# Altium schematic sheet Block_diagram.SchDoc
size C; Author: AM; CompanyName: Expatria Technologies; DrawnBy: A.Marles; Engineer: AM; Organization: Expatria Technolgoies; Address1: PO Box 2084; Address3: Merritt, BC V1K 1B8; Address4: Canada; DocumentNumber: 3; Revision: A2; SheetNumber: 3; SheetTotal: 26
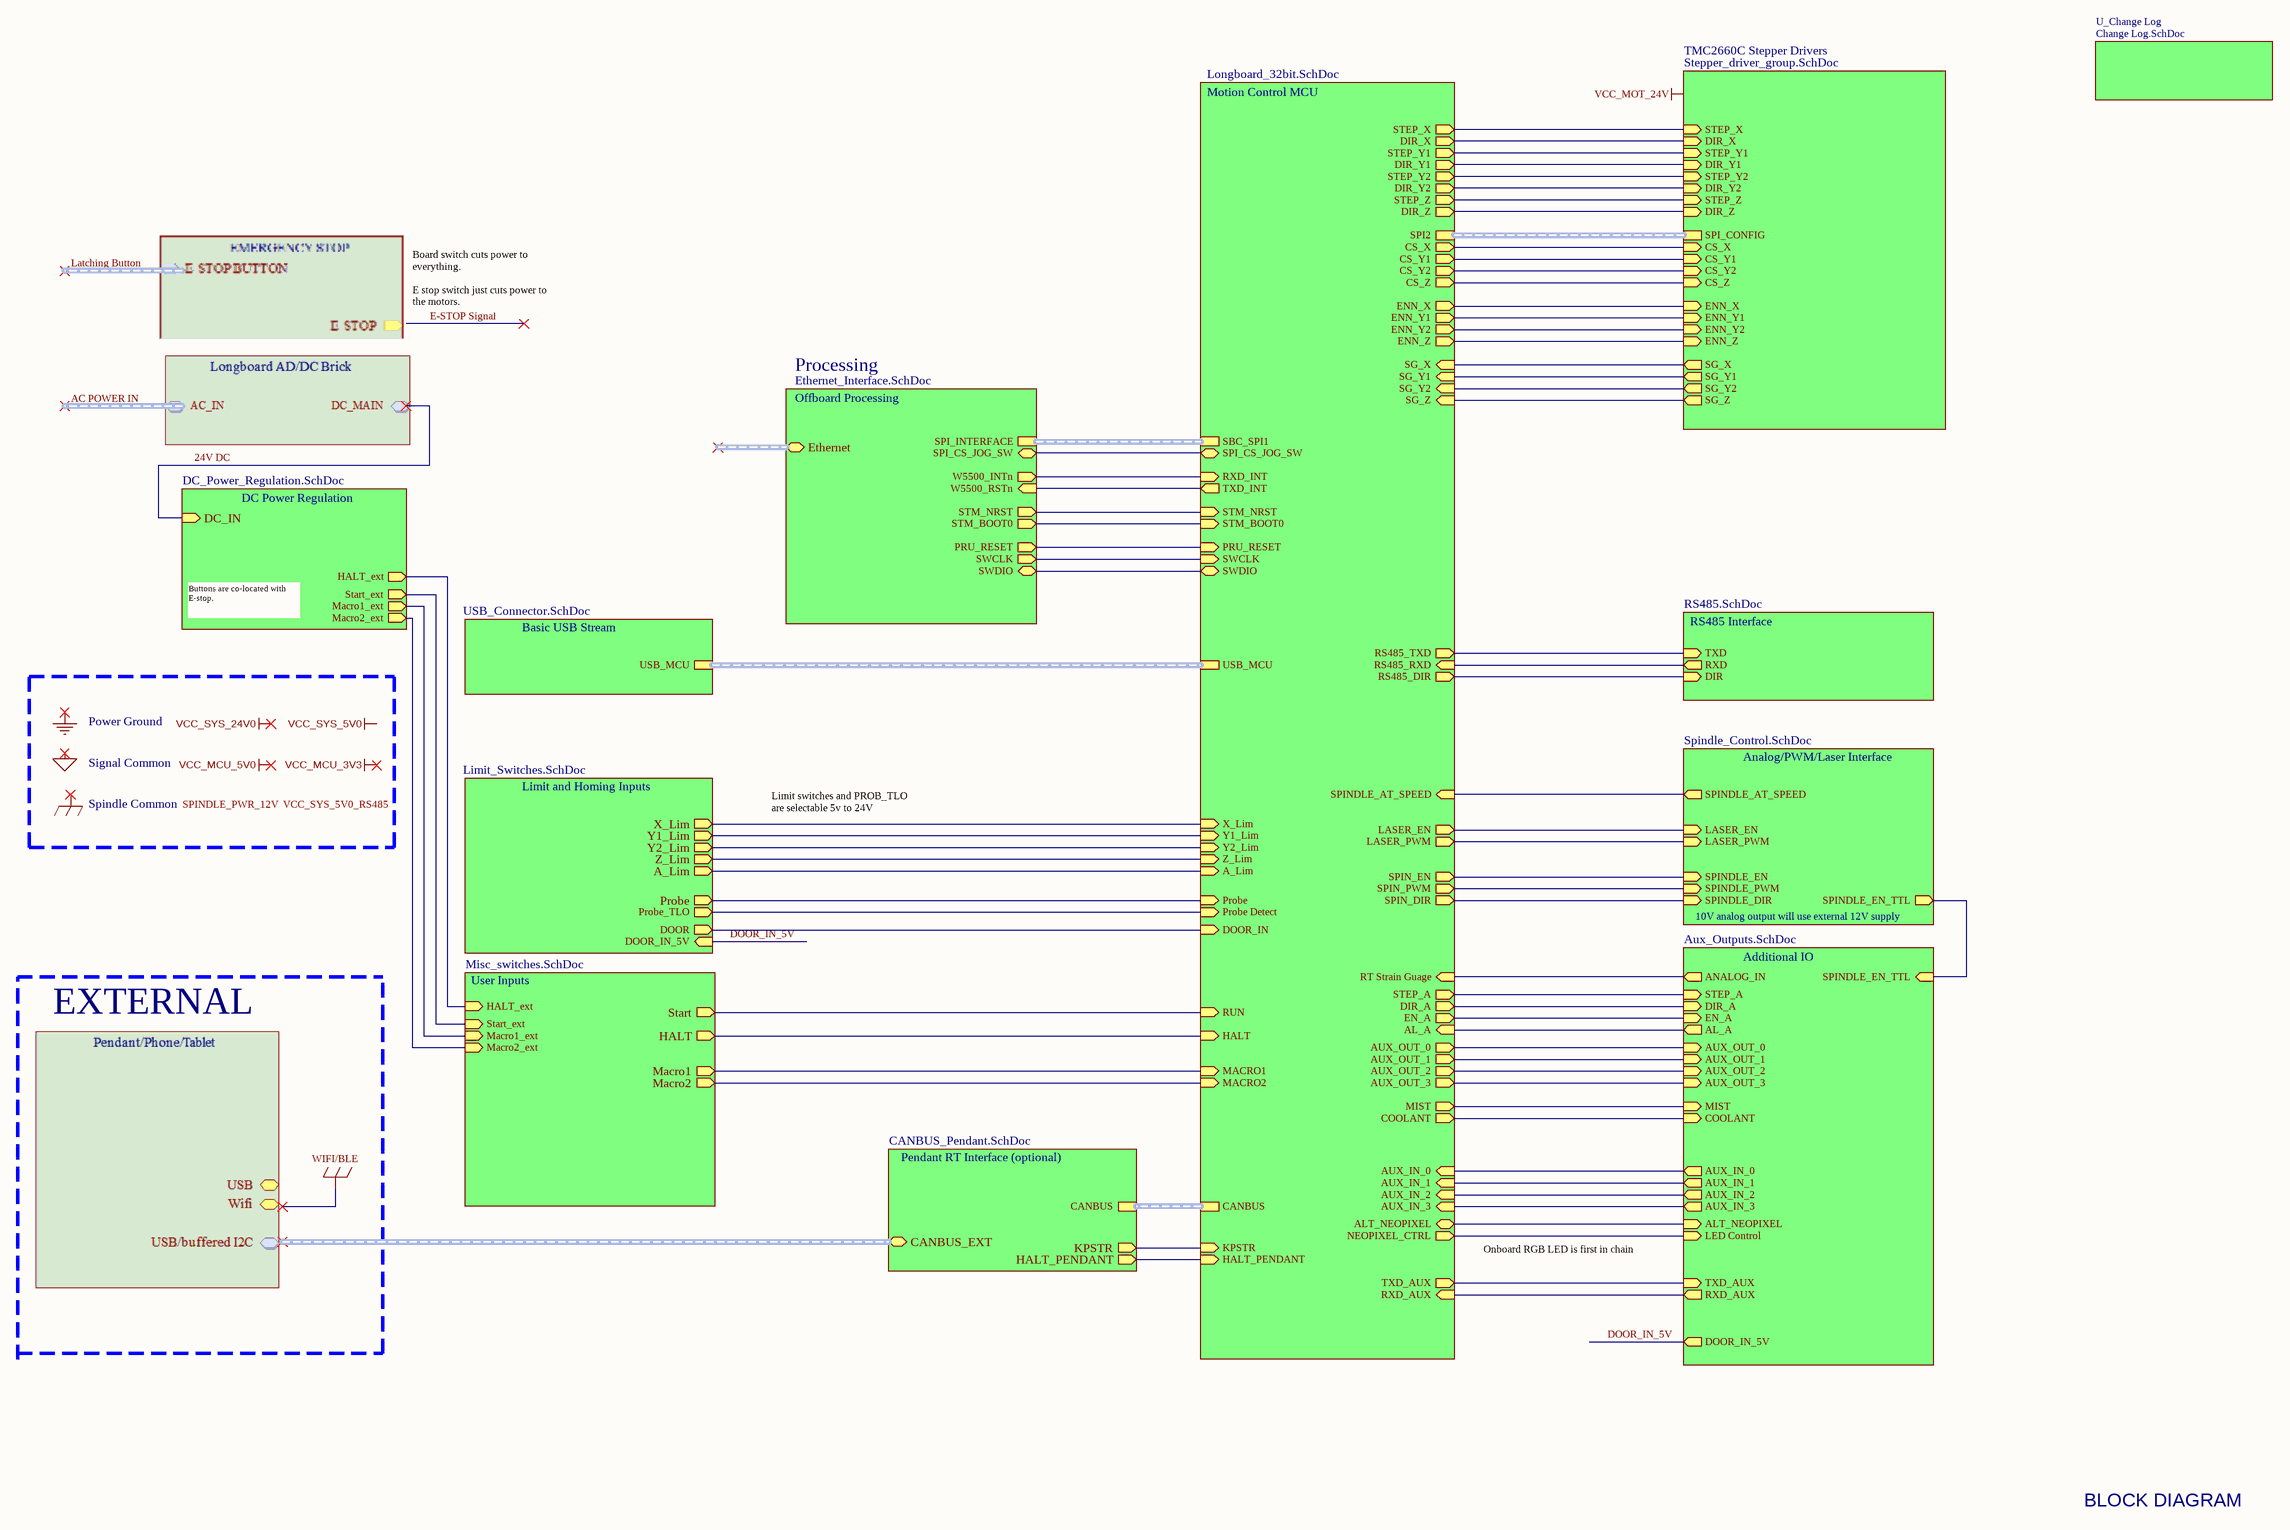
[diagram p0: Block_diagram.SchDoc]

## Sub-sheets
Additional IO = Aux_Outputs.SchDoc: STEP_A (in), DIR_A (in), AUX_OUT_0 (in), AUX_OUT_1 (in), AUX_OUT_2 (in), AUX_OUT_3 (in), AUX_IN_0 (out), AUX_IN_1 (out), AUX_IN_2 (out), AUX_IN_3 (out), LED Control (in), EN_A (in), AL_A (out), RXD_AUX (out), TXD_AUX (in), ANALOG_IN (out), COOLANT (in), MIST (in), SPINDLE_EN_TTL (in), ALT_NEOPIXEL (in), DOOR_IN_5V (out)
Analog/PWM/Laser Interface = Spindle_Control.SchDoc: LASER_PWM (in), LASER_EN (in), SPINDLE_PWM (in), SPINDLE_EN (in), SPINDLE_DIR (in), SPINDLE_AT_SPEED (out), SPINDLE_EN_TTL (out)
Basic USB Stream = USB_Connector.SchDoc: USB_MCU (harness USB2.0)
DC Power Regulation = DC_Power_Regulation.SchDoc: DC_IN (in), Start_ext (out), Macro1_ext (out), Macro2_ext (out), HALT_ext (out)
Limit and Homing Inputs = Limit_Switches.SchDoc: X_Lim (out), Y1_Lim (out), Y2_Lim (out), Z_Lim (out), A_Lim (out), Probe (out), Probe_TLO (out), DOOR (out), DOOR_IN_5V (in)
Motion Control MCU = Longboard_32bit.SchDoc: RS485_TXD (out), SPIN_PWM (out), X_Lim (in), Y1_Lim (in), Y2_Lim (in), Z_Lim (in), SPINDLE_AT_SPEED (in), RUN (in), A_Lim (in), SPIN_EN (out), Probe (in), RT Strain Guage (in), COOLANT (out), MIST (out), Probe Detect (in), STEP_X (out), DIR_X (out), STEP_Y1 (out), DIR_Y1 (out), STEP_Z (out), DIR_Z (out), STEP_Y2 (out), DIR_Y2 (out), STEP_A (out), DIR_A (out), SPIN_DIR (out), AUX_OUT_0 (out), AUX_OUT_1 (out), AUX_OUT_2 (out), AUX_OUT_3 (out), AUX_IN_0 (in), AUX_IN_1 (in), AUX_IN_2 (in), AUX_IN_3 (in), NEOPIXEL_CTRL (out), KPSTR (in), SPI2 (harness SPI), CS_X (out), CS_Y1 (out), CS_Z (out), CS_Y2 (out), HALT (in), ENN_X (out), ENN_Y1 (out), ENN_Z (out), ENN_Y2 (out), SG_X (in), SG_Y1 (in), SG_Z (in), SG_Y2 (in), EN_A (out), AL_A (in), SPI_CS_JOG_SW (bidir), LASER_PWM (out), LASER_EN (out), MACRO1 (in), MACRO2 (in), RS485_RXD (in), RS485_DIR (out), SBC_SPI1 (harness SPI), STM_NRST (in), STM_BOOT0 (in), RXD_INT (in), TXD_INT (out), CANBUS (harness CANBUS), RXD_AUX (in), TXD_AUX (out), PRU_RESET (in), SWCLK (in), SWDIO (bidir), USB_MCU (harness USB2.0), HALT_PENDANT (in), DOOR_IN (in), ALT_NEOPIXEL (bidir)
Offboard Processing = Ethernet_Interface.SchDoc: SPI_INTERFACE (harness DIFF_PAIR), Ethernet (bidir), SPI_CS_JOG_SW (bidir), STM_NRST (out), STM_BOOT0 (out), SWCLK (out), SWDIO (bidir), PRU_RESET (out), W5500_INTn (out), W5500_RSTn (in)
Pendant RT Interface (optional) = CANBUS_Pendant.SchDoc: CANBUS_EXT (bidir), KPSTR (out), HALT_PENDANT (out), CANBUS (harness CANBUS)
RS485 Interface = RS485.SchDoc: DIR (in), RXD (out), TXD (in)
TMC2660C Stepper Drivers = Stepper_driver_group.SchDoc: STEP_X (in), DIR_X (in), STEP_Y1 (in), DIR_Y1 (in), STEP_Z (in), DIR_Z (in), STEP_Y2 (in), DIR_Y2 (in), SPI_CONFIG (harness DIFF_PAIR), CS_X (in), CS_Y1 (in), CS_Z (in), CS_Y2 (in), ENN_X (in), ENN_Y1 (in), ENN_Z (in), ENN_Y2 (in), SG_X (out), SG_Y1 (out), SG_Z (out), SG_Y2 (out)
U_Change Log = Change Log.SchDoc: no entries
User Inputs = Misc_switches.SchDoc: HALT (out), Start (out), Macro1 (out), Macro2 (out), Start_ext (in), Macro1_ext (in), HALT_ext (in), Macro2_ext (in)

## Nets
24V DC: sheet DC Power Regulation/DC_IN
DOOR_IN_5V: sheet Limit and Homing Inputs/DOOR_IN_5V, sheet Additional IO/DOOR_IN_5V
(unnamed): sheet Motion Control MCU/RS485_TXD, sheet RS485 Interface/TXD
(unnamed): sheet Motion Control MCU/SPIN_PWM, sheet Analog/PWM/Laser Interface/SPINDLE_PWM
(unnamed): sheet Motion Control MCU/X_Lim, sheet Limit and Homing Inputs/X_Lim
(unnamed): sheet Motion Control MCU/Y1_Lim, sheet Limit and Homing Inputs/Y1_Lim
(unnamed): sheet Motion Control MCU/Y2_Lim, sheet Limit and Homing Inputs/Y2_Lim
(unnamed): sheet Motion Control MCU/Z_Lim, sheet Limit and Homing Inputs/Z_Lim
(unnamed): sheet Motion Control MCU/SPINDLE_AT_SPEED, sheet Analog/PWM/Laser Interface/SPINDLE_AT_SPEED
(unnamed): sheet Motion Control MCU/RUN, sheet User Inputs/Start
(unnamed): sheet Motion Control MCU/A_Lim, sheet Limit and Homing Inputs/A_Lim
(unnamed): sheet Motion Control MCU/SPIN_EN, sheet Analog/PWM/Laser Interface/SPINDLE_EN
(unnamed): sheet Motion Control MCU/Probe, sheet Limit and Homing Inputs/Probe
(unnamed): sheet Motion Control MCU/RT Strain Guage, sheet Additional IO/ANALOG_IN
(unnamed): sheet Motion Control MCU/COOLANT, sheet Additional IO/COOLANT
(unnamed): sheet Motion Control MCU/MIST, sheet Additional IO/MIST
(unnamed): sheet Motion Control MCU/Probe Detect, sheet Limit and Homing Inputs/Probe_TLO
(unnamed): sheet Motion Control MCU/STEP_X, sheet TMC2660C Stepper Drivers/STEP_X
(unnamed): sheet Motion Control MCU/DIR_X, sheet TMC2660C Stepper Drivers/DIR_X
(unnamed): sheet Motion Control MCU/STEP_Y1, sheet TMC2660C Stepper Drivers/STEP_Y1
(unnamed): sheet Motion Control MCU/DIR_Y1, sheet TMC2660C Stepper Drivers/DIR_Y1
(unnamed): sheet Motion Control MCU/STEP_Z, sheet TMC2660C Stepper Drivers/STEP_Z
(unnamed): sheet Motion Control MCU/DIR_Z, sheet TMC2660C Stepper Drivers/DIR_Z
(unnamed): sheet Motion Control MCU/STEP_Y2, sheet TMC2660C Stepper Drivers/STEP_Y2
(unnamed): sheet Motion Control MCU/DIR_Y2, sheet TMC2660C Stepper Drivers/DIR_Y2
(unnamed): sheet Motion Control MCU/STEP_A, sheet Additional IO/STEP_A
(unnamed): sheet Motion Control MCU/DIR_A, sheet Additional IO/DIR_A
(unnamed): sheet Motion Control MCU/SPIN_DIR, sheet Analog/PWM/Laser Interface/SPINDLE_DIR
(unnamed): sheet Motion Control MCU/AUX_OUT_0, sheet Additional IO/AUX_OUT_0
(unnamed): sheet Motion Control MCU/AUX_OUT_1, sheet Additional IO/AUX_OUT_1
(unnamed): sheet Motion Control MCU/AUX_OUT_2, sheet Additional IO/AUX_OUT_2
(unnamed): sheet Motion Control MCU/AUX_OUT_3, sheet Additional IO/AUX_OUT_3
(unnamed): sheet Motion Control MCU/AUX_IN_0, sheet Additional IO/AUX_IN_0
(unnamed): sheet Motion Control MCU/AUX_IN_1, sheet Additional IO/AUX_IN_1
(unnamed): sheet Motion Control MCU/AUX_IN_2, sheet Additional IO/AUX_IN_2
(unnamed): sheet Motion Control MCU/AUX_IN_3, sheet Additional IO/AUX_IN_3
(unnamed): sheet Motion Control MCU/NEOPIXEL_CTRL, sheet Additional IO/LED Control
(unnamed): sheet Motion Control MCU/KPSTR, sheet Pendant RT Interface (optional)/KPSTR
(unnamed): sheet Motion Control MCU/CS_X, sheet TMC2660C Stepper Drivers/CS_X
(unnamed): sheet Motion Control MCU/CS_Y1, sheet TMC2660C Stepper Drivers/CS_Y1
(unnamed): sheet Motion Control MCU/CS_Z, sheet TMC2660C Stepper Drivers/CS_Z
(unnamed): sheet Motion Control MCU/CS_Y2, sheet TMC2660C Stepper Drivers/CS_Y2
(unnamed): sheet Motion Control MCU/HALT, sheet User Inputs/HALT
(unnamed): sheet Motion Control MCU/ENN_X, sheet TMC2660C Stepper Drivers/ENN_X
(unnamed): sheet Motion Control MCU/ENN_Y1, sheet TMC2660C Stepper Drivers/ENN_Y1
(unnamed): sheet Motion Control MCU/ENN_Z, sheet TMC2660C Stepper Drivers/ENN_Z
(unnamed): sheet Motion Control MCU/ENN_Y2, sheet TMC2660C Stepper Drivers/ENN_Y2
(unnamed): sheet Motion Control MCU/SG_X, sheet TMC2660C Stepper Drivers/SG_X
(unnamed): sheet Motion Control MCU/SG_Y1, sheet TMC2660C Stepper Drivers/SG_Y1
(unnamed): sheet Motion Control MCU/SG_Z, sheet TMC2660C Stepper Drivers/SG_Z
(unnamed): sheet Motion Control MCU/SG_Y2, sheet TMC2660C Stepper Drivers/SG_Y2
(unnamed): sheet Motion Control MCU/EN_A, sheet Additional IO/EN_A
(unnamed): sheet Motion Control MCU/AL_A, sheet Additional IO/AL_A
(unnamed): sheet Motion Control MCU/SPI_CS_JOG_SW, sheet Offboard Processing/SPI_CS_JOG_SW
(unnamed): sheet Motion Control MCU/LASER_PWM, sheet Analog/PWM/Laser Interface/LASER_PWM
(unnamed): sheet Motion Control MCU/LASER_EN, sheet Analog/PWM/Laser Interface/LASER_EN
(unnamed): sheet Motion Control MCU/MACRO1, sheet User Inputs/Macro1
(unnamed): sheet Motion Control MCU/MACRO2, sheet User Inputs/Macro2
(unnamed): sheet Motion Control MCU/RS485_RXD, sheet RS485 Interface/RXD
(unnamed): sheet Motion Control MCU/RS485_DIR, sheet RS485 Interface/DIR
(unnamed): sheet Motion Control MCU/STM_NRST, sheet Offboard Processing/STM_NRST
(unnamed): sheet Motion Control MCU/STM_BOOT0, sheet Offboard Processing/STM_BOOT0
(unnamed): sheet Motion Control MCU/RXD_INT, sheet Offboard Processing/W5500_INTn
(unnamed): sheet Motion Control MCU/TXD_INT, sheet Offboard Processing/W5500_RSTn
(unnamed): sheet Motion Control MCU/RXD_AUX, sheet Additional IO/RXD_AUX
(unnamed): sheet Motion Control MCU/TXD_AUX, sheet Additional IO/TXD_AUX
(unnamed): sheet Motion Control MCU/PRU_RESET, sheet Offboard Processing/PRU_RESET
(unnamed): sheet Motion Control MCU/SWCLK, sheet Offboard Processing/SWCLK
(unnamed): sheet Motion Control MCU/SWDIO, sheet Offboard Processing/SWDIO
(unnamed): sheet Motion Control MCU/HALT_PENDANT, sheet Pendant RT Interface (optional)/HALT_PENDANT
(unnamed): sheet Motion Control MCU/DOOR_IN, sheet Limit and Homing Inputs/DOOR
(unnamed): sheet Motion Control MCU/ALT_NEOPIXEL, sheet Additional IO/ALT_NEOPIXEL
(unnamed): sheet User Inputs/Start_ext, sheet DC Power Regulation/Start_ext
(unnamed): sheet User Inputs/Macro1_ext, sheet DC Power Regulation/Macro1_ext
(unnamed): sheet User Inputs/HALT_ext, sheet DC Power Regulation/HALT_ext
(unnamed): sheet User Inputs/Macro2_ext, sheet DC Power Regulation/Macro2_ext
(unnamed): sheet Analog/PWM/Laser Interface/SPINDLE_EN_TTL, sheet Additional IO/SPINDLE_EN_TTL

## Buses and harness runs
harness sheet Basic USB Stream/USB_MCU = sheet Motion Control MCU/USB_MCU
harness sheet Motion Control MCU/CANBUS = sheet Pendant RT Interface (optional)/CANBUS
harness sheet Motion Control MCU/SBC_SPI1 = sheet Offboard Processing/SPI_INTERFACE
harness sheet Motion Control MCU/SPI2 = sheet TMC2660C Stepper Drivers/SPI_CONFIG

## Notes on the sheet
- Board switch cuts power to everything.
  E stop switch just cuts power to the motors.
- Processing
- Buttons are co-located with E-stop.
- Power Ground
- Spindle Common
- Signal Common
- SPINDLE_PWR_12V
- VCC_SYS_5V0_RS485
- Limit switches and PROB_TLO are selectable 5v to 24V
- 10V analog output will use external 12V supply
- EXTERNAL
- Onboard RGB LED is first in chain
- BLOCK DIAGRAM
- Labels drawn without touching a wire or pin: GND, MCU_GND, SPIN_GND, VCC_MCU_3V3, VCC_MCU_5V0, VCC_MOT_24V, VCC_SYS_5V0, VCC_SYS_24V0
- Expatria Technologies
- SHEET
- PROJECT
- REV
- EMAIL: INFO@EXPATRIA.CA
- 625 Kane Valley Rd.
- Box 2084
- Merritt, BC V1K1B8
- SIZE
- ENGR
- C
- MODIFIED
- DOCUMENT
- /
- Copyright Sienci Labs 2024. This document describes Open Hardware and is licensed under the CERN-OHL-S v2. No warranty is implied or expressed.